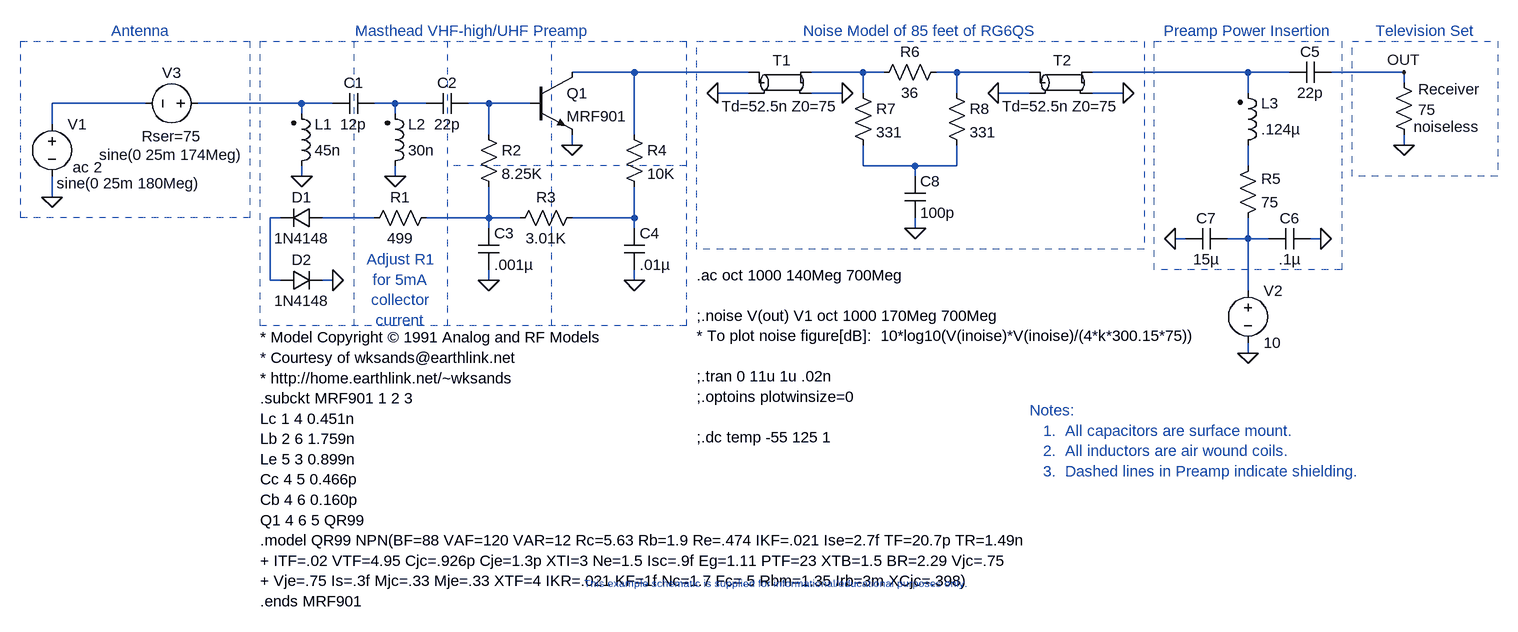
[diagram p0: schematic UHFpreamp.asc]
UHFpreamp.asc, the LTspice schematic file:
Version 4
SHEET 1 3756 944
WIRE 288 144 192 144
WIRE 464 144 288 144
WIRE 640 144 560 144
WIRE 672 144 640 144
WIRE 784 144 752 144
WIRE 896 144 784 144
WIRE 1232 144 992 144
WIRE 1296 144 1232 144
WIRE 1472 144 1360 144
WIRE 1472 160 1472 144
WIRE 464 176 416 176
WIRE 608 176 560 176
WIRE 640 176 640 144
WIRE 784 176 784 144
WIRE 896 176 848 176
WIRE 1040 176 992 176
WIRE 1232 176 1232 144
WIRE -464 192 -608 192
WIRE -224 192 -384 192
WIRE -176 192 -224 192
WIRE -80 192 -112 192
WIRE -32 192 -80 192
WIRE 64 192 32 192
WIRE 128 192 64 192
WIRE -224 208 -224 192
WIRE -80 208 -80 192
WIRE -608 224 -608 192
WIRE 64 240 64 192
WIRE 288 240 288 144
WIRE 192 256 192 240
WIRE 1472 256 1472 240
WIRE 640 288 640 256
WIRE 720 288 640 288
WIRE 784 288 784 256
WIRE 784 288 720 288
WIRE 1232 288 1232 256
WIRE -224 304 -224 288
WIRE -80 304 -80 288
WIRE 720 304 720 288
WIRE -608 336 -608 304
WIRE -256 368 -272 368
WIRE -112 368 -192 368
WIRE 64 368 64 320
WIRE 64 368 -32 368
WIRE 112 368 64 368
WIRE 288 368 288 320
WIRE 288 368 192 368
WIRE 64 384 64 368
WIRE 288 384 288 368
WIRE 720 384 720 368
WIRE 1136 400 1120 400
WIRE 1232 400 1232 368
WIRE 1232 400 1200 400
WIRE 1264 400 1232 400
WIRE 1344 400 1328 400
WIRE -272 464 -272 368
WIRE -256 464 -272 464
WIRE -176 464 -192 464
WIRE 64 464 64 448
WIRE 288 464 288 448
WIRE 1232 480 1232 400
WIRE 1232 576 1232 560
FLAG -224 304 0
FLAG -608 336 0
FLAG -80 304 0
FLAG 192 256 0
FLAG 288 464 0
FLAG 64 464 0
FLAG 720 384 0
FLAG 608 176 0
FLAG 416 176 0
FLAG 848 176 0
FLAG 1040 176 0
FLAG 1472 256 0
FLAG 1344 400 0
FLAG 1232 576 0
FLAG 1472 144 OUT
FLAG 1120 400 0
FLAG -176 464 0
SYMBOL ind2 -96 304 M180
WINDOW 0 36 80 Left 2
WINDOW 3 36 40 Left 2
SYMATTR InstName L2
SYMATTR Value 30n
SYMATTR Type ind
SYMBOL ind2 -240 304 M180
WINDOW 0 36 80 Left 2
WINDOW 3 36 40 Left 2
SYMATTR InstName L1
SYMATTR Value 45n
SYMATTR Type ind
SYMBOL voltage -608 208 R0
WINDOW 3 32 82 Left 2
WINDOW 39 7 107 Left 2
SYMATTR Value ac 2
SYMATTR SpiceLine sine(0 25m 180Meg)
SYMATTR InstName V1
SYMBOL tline 512 160 R0
WINDOW 0 3 -19 Bottom 2
WINDOW 3 0 21 Top 2
SYMATTR InstName T1
SYMATTR Value Td=52.5n Z0=75
SYMBOL tline 944 160 R0
WINDOW 0 3 -19 Bottom 2
WINDOW 3 0 21 Top 2
SYMATTR InstName T2
SYMATTR Value Td=52.5n Z0=75
SYMBOL res 768 128 R90
WINDOW 0 0 56 VBottom 2
WINDOW 3 32 56 VTop 2
SYMATTR InstName R6
SYMATTR Value 36
SYMBOL res 624 160 R0
SYMATTR InstName R7
SYMATTR Value 331
SYMBOL res 768 160 R0
SYMATTR InstName R8
SYMATTR Value 331
SYMBOL cap 704 304 R0
SYMATTR InstName C8
SYMATTR Value 100p
SYMBOL res 1456 144 R0
WINDOW 0 38 26 Left 2
WINDOW 3 38 58 Left 2
WINDOW 123 31 84 Left 2
SYMATTR InstName Receiver
SYMATTR Value 75
SYMATTR Value2 noiseless
SYMBOL ind2 1216 272 M180
WINDOW 0 36 80 Left 2
WINDOW 3 36 40 Left 2
SYMATTR InstName L3
SYMATTR Value .124µ
SYMATTR Type ind
SYMBOL voltage 1232 464 R0
SYMATTR InstName V2
SYMATTR Value 10
SYMBOL voltage -368 192 M270
WINDOW 3 -63 56 VBottom 2
WINDOW 123 -70 55 VBottom 2
WINDOW 0 32 56 VTop 2
WINDOW 39 -35 56 VBottom 2
SYMATTR Value sine(0 25m 174Meg)
SYMATTR InstName V3
SYMATTR SpiceLine Rser=75
SYMBOL npn 128 144 R0
SYMATTR InstName Q1
SYMATTR Value MRF901
SYMATTR Prefix X
SYMBOL cap -112 176 R90
WINDOW 0 0 32 VBottom 2
WINDOW 3 32 32 VTop 2
SYMATTR InstName C1
SYMATTR Value 12p
SYMBOL cap 32 176 R90
WINDOW 0 0 32 VBottom 2
WINDOW 3 32 32 VTop 2
SYMATTR InstName C2
SYMATTR Value 22p
SYMBOL res -16 352 R90
WINDOW 0 0 56 VBottom 2
WINDOW 3 32 56 VTop 2
SYMATTR InstName R1
SYMATTR Value 499
SYMBOL res 208 352 R90
WINDOW 0 0 56 VBottom 2
WINDOW 3 32 56 VTop 2
SYMATTR InstName R3
SYMATTR Value 3.01K
SYMBOL res 48 224 R0
SYMATTR InstName R2
SYMATTR Value 8.25K
SYMBOL res 272 224 R0
SYMATTR InstName R4
SYMATTR Value 10K
SYMBOL cap 48 384 R0
SYMATTR InstName C3
SYMATTR Value .001µ
SYMBOL cap 272 384 R0
SYMATTR InstName C4
SYMATTR Value .01µ
SYMBOL cap 1360 160 M270
WINDOW 0 32 32 VTop 2
WINDOW 3 0 32 VBottom 2
SYMATTR InstName C5
SYMATTR Value 22p
SYMBOL res 1216 384 M180
WINDOW 0 36 76 Left 2
WINDOW 3 36 40 Left 2
SYMATTR InstName R5
SYMATTR Value 75
SYMBOL cap 1328 416 M270
WINDOW 0 32 32 VTop 2
WINDOW 3 0 32 VBottom 2
SYMATTR InstName C6
SYMATTR Value .1µ
SYMBOL cap 1200 416 M270
WINDOW 0 32 32 VTop 2
WINDOW 3 0 32 VBottom 2
SYMATTR InstName C7
SYMATTR Value 15µ
SYMBOL diode -192 352 R90
WINDOW 0 0 32 VBottom 2
WINDOW 3 32 32 VTop 2
SYMATTR InstName D1
SYMATTR Value 1N4148
SYMBOL diode -256 448 M90
WINDOW 0 0 32 VBottom 2
WINDOW 3 32 32 VTop 2
SYMATTR InstName D2
SYMATTR Value 1N4148
TEXT 384 456 Left 2 !.ac oct 1000 140Meg 700Meg\n \n;.noise V(out) V1 oct 1000 170Meg 700Meg\n* To plot noise figure[dB]:  10*log10(V(inoise)*V(inoise)/(4*k*300.15*75))\n \n;.tran 0 11u 1u .02n\n;.optoins plotwinsize=0\n \n;.dc temp -55 125 1
TEXT 728 96 Bottom 2 ;Noise Model of 85 feet of RG6QS
TEXT -288 552 Left 2 !* Model Copyright © 1991 Analog and RF Models\n* Courtesy of wksands@earthlink.net\n* http://home.earthlink.net/~wksands\n.subckt MRF901 1 2 3\nLc 1 4 0.451n\nLb 2 6 1.759n\nLe 5 3 0.899n\nCc 4 5 0.466p\nCb 4 6 0.160p\nQ1 4 6 5 QR99\n.model QR99 NPN(BF=88 VAF=120 VAR=12 Rc=5.63 Rb=1.9 Re=.474 IKF=.021 Ise=2.7f TF=20.7p TR=1.49n\n+ ITF=.02 VTF=4.95 Cjc=.926p Cje=1.3p XTI=3 Ne=1.5 Isc=.9f Eg=1.11 PTF=23 XTB=1.5 BR=2.29 Vjc=.75\n+ Vje=.75 Is=.3f Mjc=.33 Mje=.33 XTF=4 IKR=.021 KF=1f Nc=1.7 Fc=.5 Rbm=1.35 Irb=3m XCjc=.398)\n.ends MRF901
TEXT 40 96 Bottom 2 ;Masthead VHF-high/UHF Preamp
TEXT 1232 96 Bottom 2 ;Preamp Power Insertion
TEXT -72 416 Top 2 ;Adjust R1\nfor 5mA\ncollector\ncurrent
TEXT -472 96 Bottom 2 ;Antenna
TEXT 896 664 Left 2 ;Notes: \n   1.  All capacitors are surface mount.\n   2.  All inductors are air wound coils.\n   3.  Dashed lines in Preamp indicate shielding.
TEXT 1504 96 Bottom 2 ;Television Set
TEXT 496 920 Top 1 ;This example schematic is supplied for informational/educational purposes only.
LINE Normal -144 96 -144 534 2
LINE Normal 0 96 0 534 2
LINE Normal 160 96 160 534 2
LINE Normal 368 288 0 288 2
RECTANGLE Normal 368 534 -288 96 2
RECTANGLE Normal 1072 416 384 96 2
RECTANGLE Normal 1376 448 1088 96 2
RECTANGLE Normal -304 368 -656 96 2
RECTANGLE Normal 1616 304 1392 96 2

The netlist it stands for:
* UHFpreamp.asc
L2 0 N007 30n
L1 0 N006 45n
V1 N005 0 ac 2 sine(0 25m 180Meg)
T1 N001 0 N002 0 Td=52.5n Z0=75
T2 N003 0 N004 0 Td=52.5n Z0=75
R6 N003 N002 36
R7 N002 N009 331
R8 N003 N009 331
C8 N009 0 100p
Receiver OUT 0 75 noiseless
L3 N010 N004 .124µ
V2 N015 0 10
V3 N006 N005 sine(0 25m 174Meg) Rser=75
XQ1 N001 N008 0 MRF901  ; pins C B E
C1 N007 N006 12p
C2 N008 N007 22p
R1 N013 N012 499
R3 N014 N013 3.01K
R2 N008 N013 8.25K
R4 N001 N014 10K
C3 N013 0 .001µ
C4 N014 0 .01µ
C5 OUT N004 22p
R5 N015 N010 75
C6 0 N015 .1µ
C7 N015 0 15µ
D1 N012 N011 1N4148
D2 N011 0 1N4148
.model D D
.lib standard.dio
.ac oct 1000 140Meg 700Meg
;.noise V(out) V1 oct 1000 170Meg 700Meg
* To plot noise figure[dB]:  10*log10(V(inoise)*V(inoise)/(4*k*300.15*75))
;.tran 0 11u 1u .02n
;.optoins plotwinsize=0
;.dc temp -55 125 1
* Noise Model of 85 feet of RG6QS
* Model Copyright © 1991 Analog and RF Models
* Courtesy of wksands@earthlink.net
* http://home.earthlink.net/~wksands
.subckt MRF901 1 2 3
Lc 1 4 0.451n
Lb 2 6 1.759n
Le 5 3 0.899n
Cc 4 5 0.466p
Cb 4 6 0.160p
Q1 4 6 5 QR99
.model QR99 NPN(BF=88 VAF=120 VAR=12 Rc=5.63 Rb=1.9 Re=.474 IKF=.021 Ise=2.7f TF=20.7p TR=1.49n
+ ITF=.02 VTF=4.95 Cjc=.926p Cje=1.3p XTI=3 Ne=1.5 Isc=.9f Eg=1.11 PTF=23 XTB=1.5 BR=2.29 Vjc=.75
+ Vje=.75 Is=.3f Mjc=.33 Mje=.33 XTF=4 IKR=.021 KF=1f Nc=1.7 Fc=.5 Rbm=1.35 Irb=3m XCjc=.398)
.ends MRF901
* Masthead VHF-high/UHF Preamp
* Preamp Power Insertion
* Adjust R1
* for 5mA
* collector
* current
* Antenna
* Notes:
*    1.  All capacitors are surface mount.
*    2.  All inductors are air wound coils.
*    3.  Dashed lines in Preamp indicate shielding.
* Television Set
* This example schematic is supplied for informational/educational purposes only.
.backanno
.end